# EasyEDA Pro project busmaster-v101.eprj, schematic main-board

## Sheets
1 psu: Board Name: main-board; Create Date: 2025-09-19; Page Name: psu; Project Name: busmaster-v101; Schematic Name: main-board; Update Date: 2025-11-22; Company: EasyEDA.com; Page Size: A4; Version: V1.0
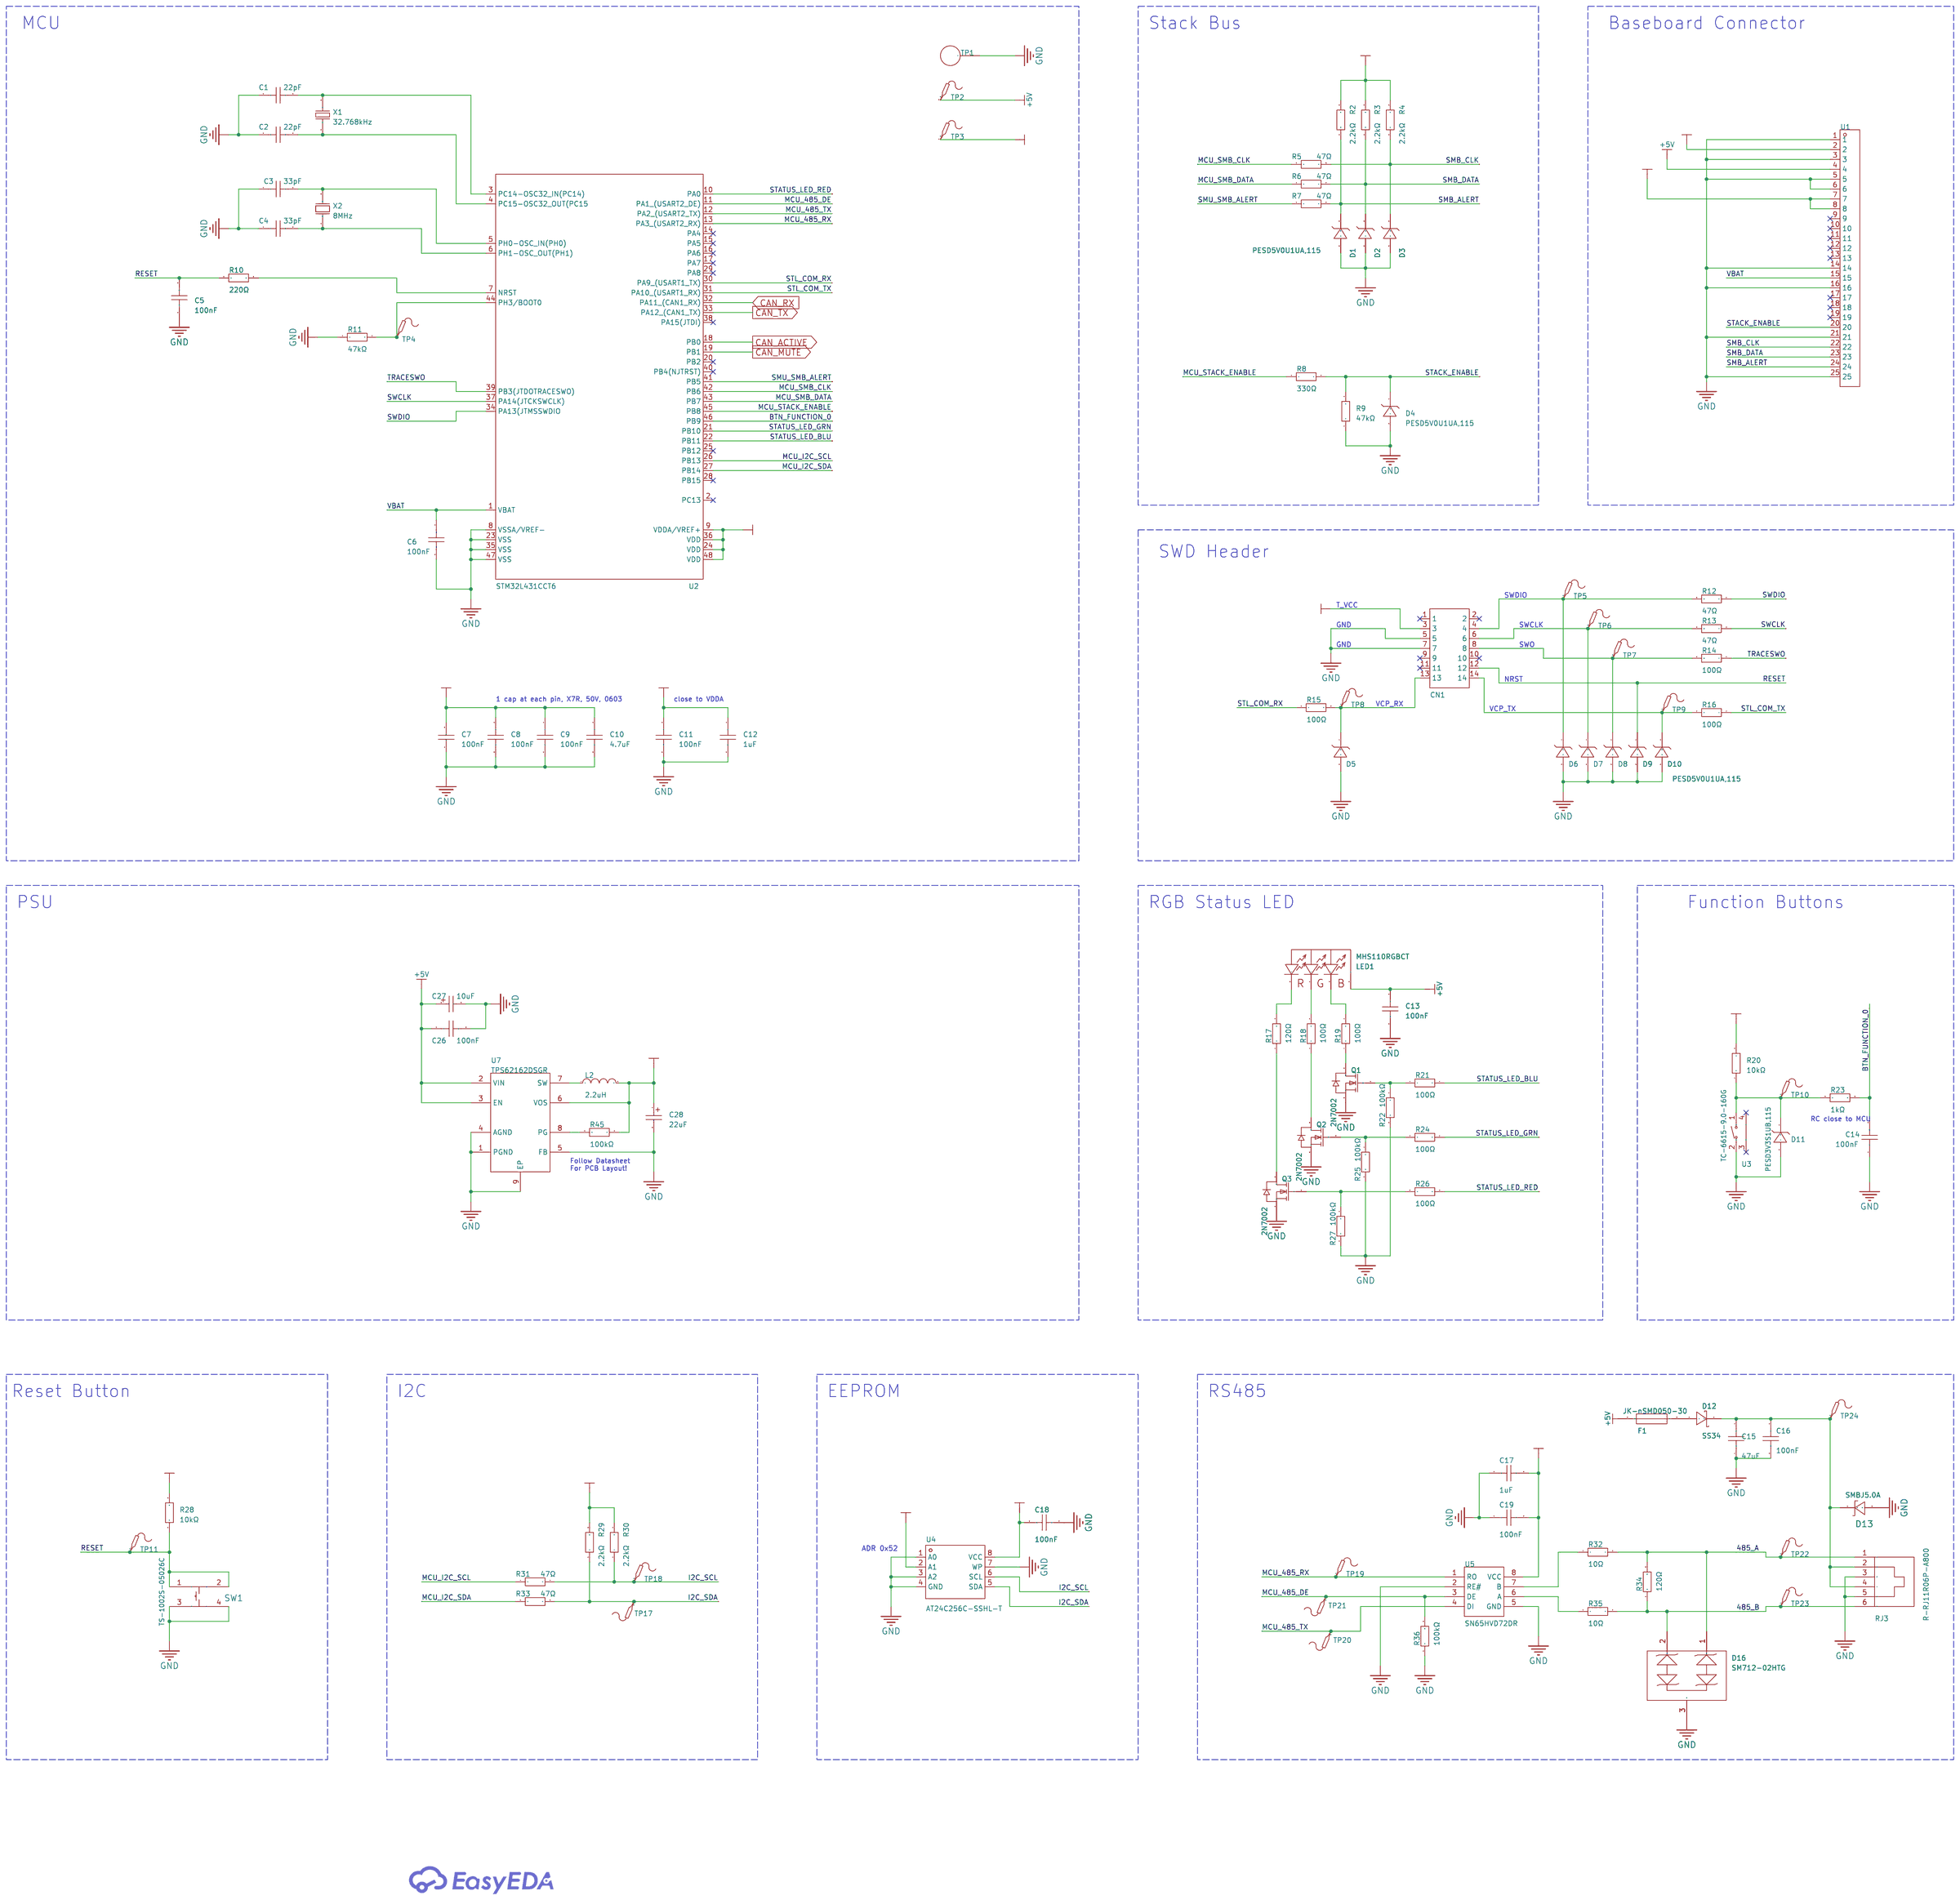
[diagram p1: psu]
2 can: Create Date: 2025-11-20; Page Name: can
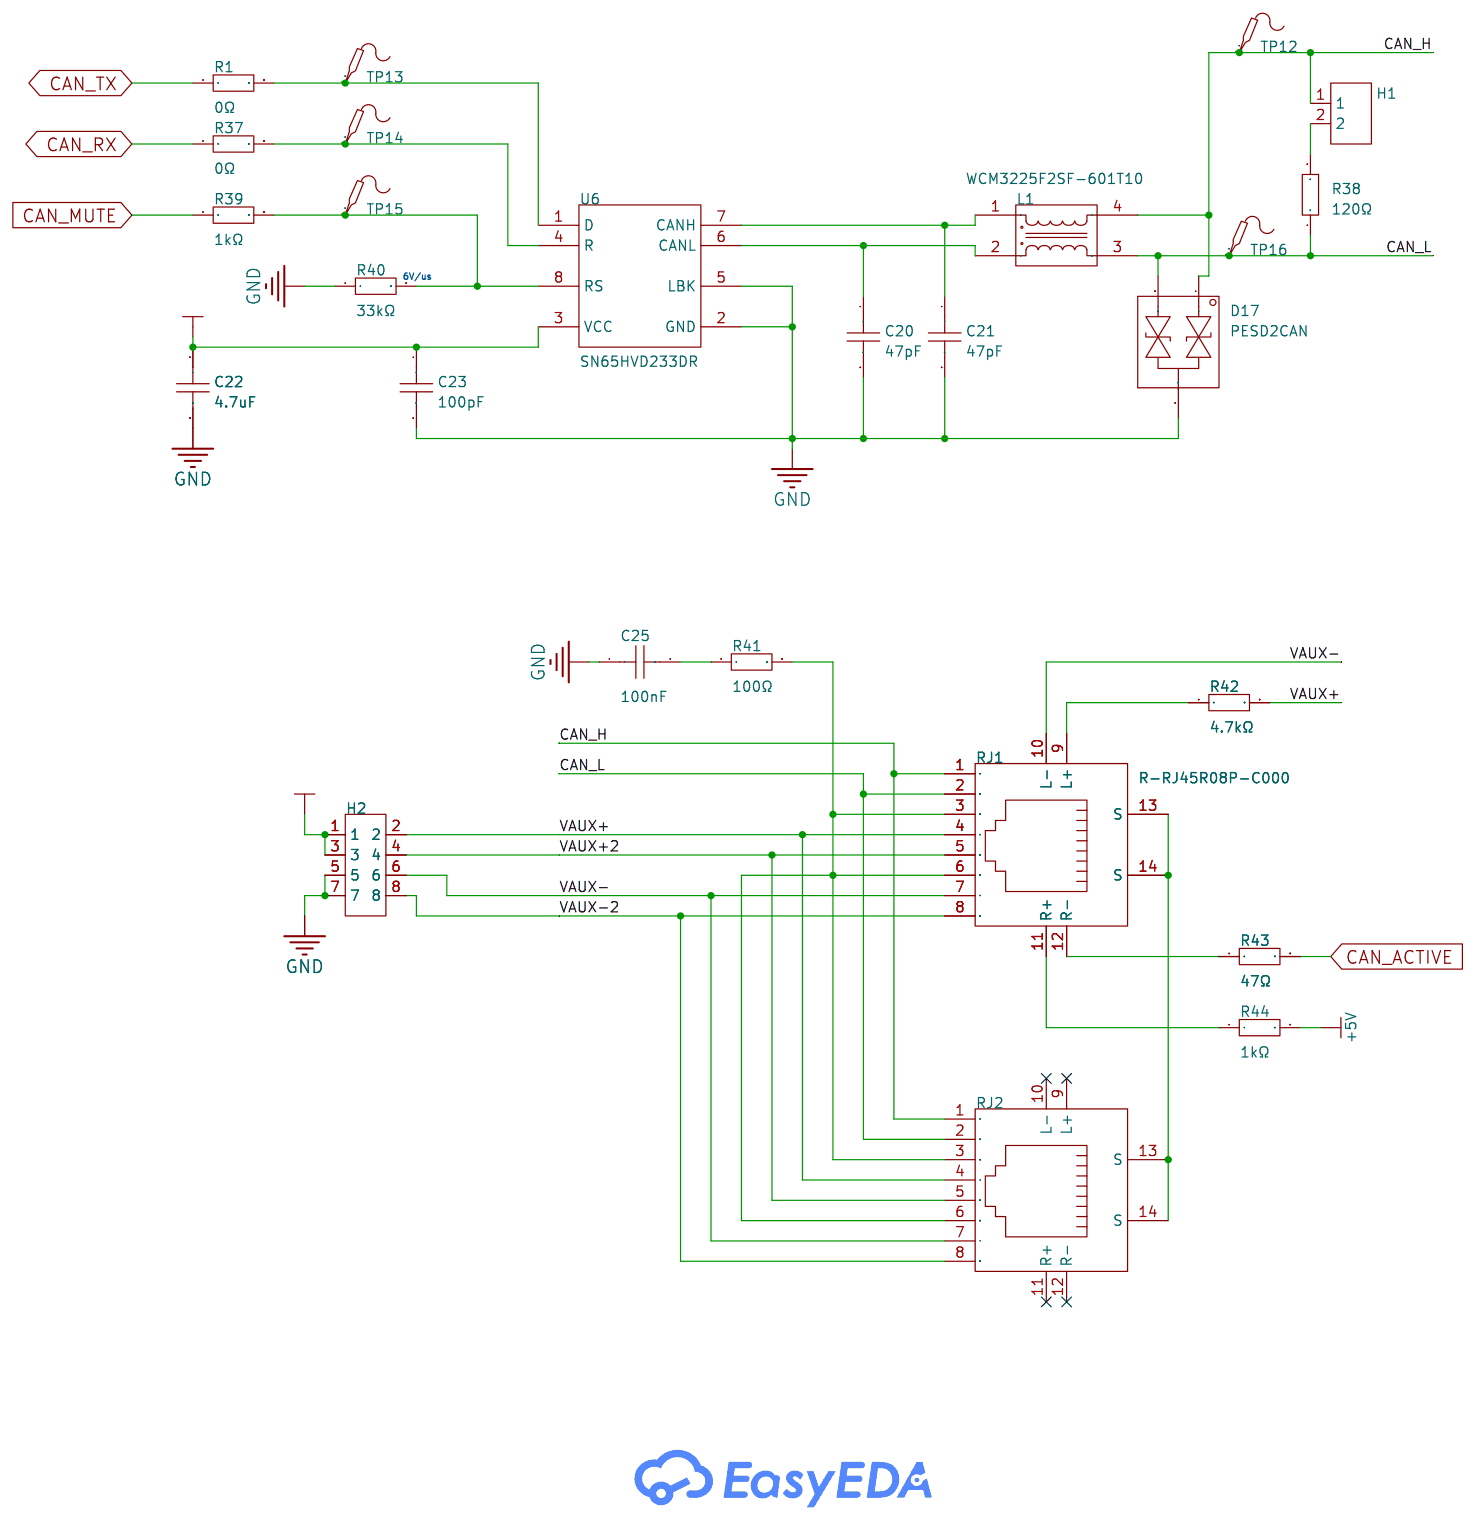
[diagram p2: can]

## Parts
sheet can
C20  47pF  [C0603]
C21  47pF  [C0603]
C22  4.7uF  [C0603]
C23  100pF  [C0603]
C25  100nF  [C0603]
D17  PESD2CAN  [SOT-23-3_L2.9-W1.3-P1.90-LS2.4-BR]
H1  PZ254V-11-02P  [HDR-TH_2P-P2.54-V-M]
H2  PZ254V-12-8P  [HDR-TH_8P-P2.54-V-M-R2-C4-S2.54]  (no BOM)
L1  WCM3225F2SF-601T10  [FILTER-SMD_4P-L3.2-W2.5-TL_ACM3225]
R1  0Ω  [R0603]
R37  0Ω  [R0603]
R38  120Ω  [R1206]
R39  1kΩ  [R0603]
R40  33kΩ  [R0603]
R41  100Ω  [R1206]
R42  4.7kΩ  [R0603]
R43  47Ω  [R0603]
R44  1kΩ  [R0603]
RJ1  R-RJ45R08P-C000  [RJ45-TH_R-RJ45R08P-C000]
RJ2  R-RJ45R08P-C000  [RJ45-TH_R-RJ45R08P-C000]
TP12  -  [Test-Point-0.5mm]
TP13  -  [Test-Point-0.5mm]
TP14  -  [Test-Point-0.5mm]
TP15  -  [Test-Point-0.5mm]
TP16  -  [Test-Point-0.5mm]
U6  SN65HVD233DR  [SOIC-8_L5.0-W4.0-P1.27-LS6.0-BL]
sheet psu
C1  22pF  [C0603]
C2  22pF  [C0603]
C3  33pF  [C0603]
C4  33pF  [C0603]
C5  100nF  [C0603]
C6  100nF  [C0603]
C7  100nF  [C0603]
C8  100nF  [C0603]
C9  100nF  [C0603]
C10  4.7uF  [C0603]
C11  100nF  [C0603]
C12  1uF  [C0603]
C13  100nF  [C0603]
C14  100nF  [C0603]
C15  47uF  [C1206]
C16  100nF  [C0603]
C17  1uF  [C0603]
C18  100nF  [C0603]
C19  100nF  [C0603]
C26  100nF  [C0603]
C27  10uF  [C0805]
C28  22uF  [C1206]
CN1  HX PZ1.27-2x7P WZ  [HDR-TH_14P-P1.27-H-M-R2-C7-S1.27-W7.5-N]
D1  PESD5V0U1UA,115  [SOD-323_L1.8-W1.3-LS2.5-RD]
D2  PESD5V0U1UA,115  [SOD-323_L1.8-W1.3-LS2.5-RD]
D3  PESD5V0U1UA,115  [SOD-323_L1.8-W1.3-LS2.5-RD]
D4  PESD5V0U1UA,115  [SOD-323_L1.8-W1.3-LS2.5-RD]
D5  PESD5V0U1UA,115  [SOD-323_L1.8-W1.3-LS2.5-RD]
D6  PESD5V0U1UA,115  [SOD-323_L1.8-W1.3-LS2.5-RD]
D7  PESD5V0U1UA,115  [SOD-323_L1.8-W1.3-LS2.5-RD]
D8  PESD5V0U1UA,115  [SOD-323_L1.8-W1.3-LS2.5-RD]
D9  PESD5V0U1UA,115  [SOD-323_L1.8-W1.3-LS2.5-RD]
D10  PESD5V0U1UA,115  [SOD-323_L1.8-W1.3-LS2.5-RD]
D11  PESD3V3S1UB,115  [SOD-523_L1.2-W0.8-LS1.6-RD]
D12  SS34  [SMA_L4.3-W2.6-LS5.2-RD]
D13  SMBJ5.0A  [SMB_L4.6-W3.6-LS5.3-RD]
D16  SM712-02HTG  [SOT-23_L2.9-W1.3-P1.90-LS2.4-BR]
F1  JK-nSMD050-30  [F1206]
L2  2.2uH  [IND-SMD_L2.0-W1.6-1]
LED1  MHS110RGBCT  [LED-ARRAY-SMD_MHS110RGBCT]
Q1  2N7002  [SOT-23-3_L2.9-W1.3-P1.90-LS2.4-BR]
Q2  2N7002  [SOT-23-3_L2.9-W1.3-P1.90-LS2.4-BR]
Q3  2N7002  [SOT-23-3_L2.9-W1.3-P1.90-LS2.4-BR]
R2  2.2kΩ  [R0603]
R3  2.2kΩ  [R0603]
R4  2.2kΩ  [R0603]
R5  47Ω  [R0603]
R6  47Ω  [R0603]
R7  47Ω  [R0603]
R8  330Ω  [R0603]
R9  47kΩ  [R0603]
R10  220Ω  [R0603]
R11  47kΩ  [R0603]
R12  47Ω  [R0603]
R13  47Ω  [R0603]
R14  100Ω  [R0603]
R15  100Ω  [R0603]
R16  100Ω  [R0603]
R17  120Ω  [R0603]
R18  100Ω  [R0603]
R19  100Ω  [R0603]
R20  10kΩ  [R0603]
R21  100Ω  [R0603]
R22  100kΩ  [R0603]
R23  1kΩ  [R0603]
R24  100Ω  [R0603]
R25  100kΩ  [R0603]
R26  100Ω  [R0603]
R27  100kΩ  [R0603]
R28  10kΩ  [R0603]
R29  2.2kΩ  [R0603]
R30  2.2kΩ  [R0603]
R31  47Ω  [R0603]
R32  10Ω  [R1206]
R33  47Ω  [R0603]
R34  120Ω  [R1206]
R35  10Ω  [R1206]
R36  100kΩ  [R0603]
R45  100kΩ  [R0603]
RJ3  R-RJ11R06P-A800  [RJ11-TH_PCB-6P6C-90]
SW1  TS-1002S-05026C  [KEY-SMD_4P-L6.0-W6.0-P4.50-LS9.0]
TP1  RH-5004  [TESTPOINT_TH_BD2.5-D1.2]
TP2  -  [Test-Point-0.5mm]
TP3  -  [Test-Point-0.5mm]
TP4  -  [Test-Point-0.5mm]
TP5  -  [Test-Point-0.5mm]
TP6  -  [Test-Point-0.5mm]
TP7  -  [Test-Point-0.5mm]
TP8  -  [Test-Point-0.5mm]
TP9  -  [Test-Point-0.5mm]
TP10  -  [Test-Point-0.5mm]
TP11  -  [Test-Point-0.5mm]
TP17  -  [Test-Point-0.5mm]
TP18  -  [Test-Point-0.5mm]
TP19  -  [Test-Point-0.5mm]
TP20  -  [Test-Point-0.5mm]
TP21  -  [Test-Point-0.5mm]
TP22  -  [Test-Point-0.5mm]
TP23  -  [Test-Point-0.5mm]
TP24  -  [Test-Point-0.5mm]
U1  KH-2PH90-1X25P-L10.5  [HDR-TH_25P-P2.00-H-M-W7.5-N]
U2  STM32L431CCT6  [LQFP-48_L7.0-W7.0-P0.50-LS9.0-BL]
U3  TC-6615-9.0-160G  [KEY-TH_PTS645VXX83XLFS]
U4  AT24C256C-SSHL-T  [SOIC-8_L4.9-W3.9-P1.27-LS6.0-BL]
U5  SN65HVD72DR  [SOIC-8_L5.0-W4.0-P1.27-LS6.0-BL]
U7  TPS62162DSGR  [WSON-8_L2.0-W2.0-P0.50-TL-EP]
X1  32.768kHz  [FC-135R_L3.2-W1.5]
X2  8MHz  [CRYSTAL-SMD_L5.0-W3.2]

## Library data of the parts
C20 C21 = CL10C470JB8NNNC: Capacitance:47pF Tolerance:±5% Tolerance:±5% Voltage Rating:50V Temperature Coefficient:C0G; LCSC Part Name: 47pF ±5% 50V; Supplier Part: C1671; Manufacturer: SAMSUNG(三星); Supplier Footprint: 0603; JLCPCB Part Class: Basic Part; Datasheet: https://item.szlcsc.com/datasheet/CL10C470JB8NNNC/2023.html; Supplier: LCSC; Tolerance: ±5%; Voltage Rating: 50V; Temperature Coefficient: C0G
C10 C22 = CL10A475KO8NNNC: Capacitance:4.7uF Tolerance:±10% Tolerance:±10% Voltage Rating:16V Temperature Coefficient:X5R; LCSC Part Name: 4.7uF ±10% 16V; Supplier Part: C19666; Manufacturer: SAMSUNG(三星); Supplier Footprint: 0603; JLCPCB Part Class: Basic Part; Datasheet: https://item.szlcsc.com/datasheet/CL10A475KO8NNNC/20375.html; Supplier: LCSC; Tolerance: ±10%; Voltage Rating: 16V; Temperature Coefficient: X5R
C23 = CL10C101JB8NNNC: Capacitance:100pF Tolerance:±5% Tolerance:±5% Voltage Rating:50V Temperature Coefficient:C0G; LCSC Part Name: 100pF ±5% 50V; Supplier Part: C14858; Manufacturer: SAMSUNG(三星); Supplier Footprint: 0603; JLCPCB Part Class: Basic Part; Datasheet: https://item.szlcsc.com/datasheet/CL10C101JB8NNNC/15530.html; Supplier: LCSC; Tolerance: ±5%; Voltage Rating: 50V; Temperature Coefficient: C0G
C5-C9 C11 C13 C14 C16 C18 C19 C25 C26 = CC0603KRX7R9BB104: Capacitance:100nF Tolerance:±10% Tolerance:±10% Voltage Rating:50V Temperature Coefficient:X7R; LCSC Part Name: 100nF ±10% 50V; Supplier Part: C14663; Manufacturer: YAGEO(国巨); Supplier Footprint: 0603; JLCPCB Part Class: Basic Part; Datasheet: https://item.szlcsc.com/datasheet/CC0603KRX7R9BB104/15331.html; Supplier: LCSC; Tolerance: ±10%; Voltage Rating: 50V; Temperature Coefficient: X7R
D17 = PESD2CAN: Supplier Part: C284078; Manufacturer: DOWO(东沃); Supplier Footprint: SOT-23; JLCPCB Part Class: Extended Part; Datasheet: https://item.szlcsc.com/datasheet/PESD2CAN/269579.html; Supplier: LCSC; Reverse Stand-Off Voltage (Vrwm): 24V; Clamping Voltage: 54V; Peak Pulse Current (Ipp): 8A@8/20us; Voltage - Breakdown: 26.7V; Type: TVS
H1 = PZ254V-11-02P: LCSC Part Name: 1x2P 间距:2.54mm 方针 直插; Supplier Part: C492401; Manufacturer: XFCN(兴飞); Supplier Footprint: 插件,P=2.54mm; JLCPCB Part Class: Extended Part; Datasheet: https://item.szlcsc.com/datasheet/PZ254V-11-02P/502957.html; Supplier: LCSC; Pin Structure: 1x2P; Pitch: 2.54mm; Circluar Pins/Square Pins: Pin Header; Mounting Type: Through Hole; Number of Rows: 1; Number of Pins: 2P; Length of Mating Pin: 6mm; Insulation Height: 2.5mm; Length of End Connection Pin: 3mm; Contact Material: Brass; Operating Temperature: -40℃~+105℃; Color: Black
H2 = PZ254V-12-8P: LCSC Part Name: 2x4P 间距:2.54mm 方针 直插; Supplier Part: C492421; Manufacturer: XFCN(兴飞); Supplier Footprint: 插件,P=2.54mm; JLCPCB Part Class: Extended Part; Datasheet: https://item.szlcsc.com/datasheet/PZ254V-12-8P/502977.html; Supplier: LCSC; Pin Structure: 2x4P; Pitch: 2.54mm; Row Spacing: 2.54mm; Circluar Pins/Square Pins: Pin Header; Mounting Type: Through Hole; Number of Rows: 2; Number of Pins: 8P; Length of Mating Pin: 6mm; Insulation Height: 2.5mm; Length of End Connection Pin: 3mm; Contact Material: Brass; Operating Temperature: -40℃~+105℃; Color: Black
L1 = WCM3225F2SF-601T10: LCSC Part Name: 两路 贴片共模滤波器 阻抗600Ω@100MHz; Supplier Part: C192894; Manufacturer: TAI-TECH(台庆); Supplier Footprint: SMD-4P,3.2x2.5mm; JLCPCB Part Class: Extended Part; Datasheet: https://item.szlcsc.com/datasheet/WCM3225F2SF-601T10/225854.html; Supplier: LCSC; Number of Lines: 2; Current Rating: 1A; Impedance @ Frequency: 600Ω@100MHz; Voltage Rating - DC: 50V; Voltage Withstand: 125V; DC Resistance(DCR): 200mΩ; Operating Temperature: -40℃~+125℃; Insulation Resistance(IR): 10MΩ
R1 R37 = 0603WAF0000T5E: Type:Thick Film Resistor Resistance:0Ω Tolerance:±1% Tolerance:±1% Power(Watts):100mW Voltage-Supply(Max):75V Temperature Coefficient:- Temperature Coefficient:- Operating Temperature:-55℃~+155℃ Operating Temperature:-55℃~+155℃; LCSC Part Name: 0Ω ±1% 100mW 厚膜电阻; Supplier Part: C21189; Manufacturer: UNI-ROYAL(厚声); Supplier Footprint: 0603; JLCPCB Part Class: Basic Part; Datasheet: https://item.szlcsc.com/datasheet/0603WAF0000T5E/21903.html; Supplier: LCSC; Type: Thick Film Resistor; Tolerance: ±1%; Power(Watts): 100mW; Voltage-Supply(Max): 75V; Operating Temperature: -55℃~+155℃
R34 R38 = 1206W4F1200T5E_C17909: Type:Thick Film Resistor Resistance:120Ω Tolerance:±1% Tolerance:±1% Power(Watts):250mW Voltage-Supply(Max):200V Temperature Coefficient:±100ppm/℃ Temperature Coefficient:±100ppm/℃ Operating Temperature:-55℃~+155℃ Operating Temperature:-55℃~+155℃; LCSC Part Name: 120Ω ±1% 250mW 厚膜电阻; Supplier Part: C17909; Manufacturer: UNI-ROYAL(厚声); Manufacturer Part: 1206W4F1200T5E; Supplier Footprint: 1206; JLCPCB Part Class: Basic Part; Datasheet: https://item.szlcsc.com/datasheet/1206W4F1200T5E/18597.html; Supplier: LCSC; Type: Thick Film Resistor; Tolerance: ±1%; Power(Watts): 250mW; Voltage-Supply(Max): 200V; Temperature Coefficient: ±100ppm/℃; Operating Temperature: -55℃~+155℃
R39 R44 = 0603WAF1001T5E: Type:Thick Film Resistor Resistance:1kΩ Tolerance:±1% Tolerance:±1% Power(Watts):100mW Voltage-Supply(Max):75V Temperature Coefficient:±100ppm/℃ Temperature Coefficient:±100ppm/℃ Operating Temperature:-55℃~+155℃ Operating Temperature:-55℃~+155℃; LCSC Part Name: 1kΩ ±1% 100mW 厚膜电阻; Supplier Part: C21190; Manufacturer: UNI-ROYAL(厚声); Supplier Footprint: 0603; JLCPCB Part Class: Basic Part; Datasheet: https://atta.szlcsc.com/upload/public/pdf/source/20200306/C422600_1E6D84923E4A46A82E41ADD87F860B5C.pdf; Supplier: LCSC; Type: Thick Film Resistors; Tolerance: ±1%; Power(Watts): 100mW; Temperature Coefficient: ±100ppm/℃; Operating Temperature Range: -55℃~+155℃; Voltage-Supply(Max): 75V; Operating Temperature: -55℃~+155℃
R40 = 0603WAF3302T5E: Type:Thick Film Resistor Resistance:33kΩ Tolerance:±1% Tolerance:±1% Power(Watts):100mW Voltage-Supply(Max):75V Temperature Coefficient:±100ppm/℃ Temperature Coefficient:±100ppm/℃ Operating Temperature:-55℃~+155℃ Operating Temperature:-55℃~+155℃; LCSC Part Name: 33kΩ ±1% 100mW 厚膜电阻; Supplier Part: C4216; Manufacturer: UNI-ROYAL(厚声); Supplier Footprint: 0603; JLCPCB Part Class: Basic Part; Datasheet: https://item.szlcsc.com/datasheet/0603WAF3302T5E/4623.html; Supplier: LCSC; Type: Thick Film Resistor; Tolerance: ±1%; Power(Watts): 100mW; Voltage-Supply(Max): 75V; Temperature Coefficient: ±100ppm/℃; Operating Temperature: -55℃~+155℃
R41 = 1206W4F1000T5E_C17901: Type:Thick Film Resistor Resistance:100Ω Tolerance:±1% Tolerance:±1% Power(Watts):250mW Voltage-Supply(Max):200V Temperature Coefficient:±100ppm/℃ Temperature Coefficient:±100ppm/℃ Operating Temperature:-55℃~+155℃ Operating Temperature:-55℃~+155℃; LCSC Part Name: 100Ω ±1% 250mW 厚膜电阻; Supplier Part: C17901; Manufacturer: UNI-ROYAL(厚声); Manufacturer Part: 1206W4F1000T5E; Supplier Footprint: 1206; JLCPCB Part Class: Basic Part; Datasheet: https://item.szlcsc.com/datasheet/1206W4F1000T5E/18589.html; Supplier: LCSC; Type: Thick Film Resistor; Tolerance: ±1%; Power(Watts): 250mW; Voltage-Supply(Max): 200V; Temperature Coefficient: ±100ppm/℃; Operating Temperature: -55℃~+155℃
R42 = 0603WAF4701T5E: Type:Thick Film Resistor Resistance:4.7kΩ Tolerance:±1% Tolerance:±1% Power(Watts):100mW Voltage-Supply(Max):75V Temperature Coefficient:±100ppm/℃ Temperature Coefficient:±100ppm/℃ Operating Temperature:-55℃~+155℃ Operating Temperature:-55℃~+155℃; LCSC Part Name: 4.7kΩ ±1% 100mW 厚膜电阻; Supplier Part: C23162; Manufacturer: UNI-ROYAL(厚声); Supplier Footprint: 0603; JLCPCB Part Class: Basic Part; Datasheet: https://item.szlcsc.com/datasheet/0603WAF4701T5E/23889.html; Supplier: LCSC; Type: Thick Film Resistor; Tolerance: ±1%; Power(Watts): 100mW; Voltage-Supply(Max): 75V; Temperature Coefficient: ±100ppm/℃; Operating Temperature: -55℃~+155℃
R5-R7 R12 R13 R31 R33 R43 = 0603WAF470JT5E: Type:Thick Film Resistor Resistance:47Ω Tolerance:±1% Tolerance:±1% Power(Watts):100mW Voltage-Supply(Max):75V Temperature Coefficient:±100ppm/℃ Temperature Coefficient:±100ppm/℃ Operating Temperature:-55℃~+155℃ Operating Temperature:-55℃~+155℃; LCSC Part Name: 47Ω ±1% 100mW 厚膜电阻; Supplier Part: C23182; Manufacturer: UNI-ROYAL(厚声); Supplier Footprint: 0603; JLCPCB Part Class: Basic Part; Datasheet: https://item.szlcsc.com/datasheet/0603WAF470JT5E/23909.html; Supplier: LCSC; Type: Thick Film Resistor; Tolerance: ±1%; Power(Watts): 100mW; Voltage-Supply(Max): 75V; Temperature Coefficient: ±100ppm/℃; Operating Temperature: -55℃~+155℃
RJ1 RJ2 = R-RJ45R08P-C000: LCSC Part Name: 弯插 带LED; Supplier Part: C386757; Manufacturer: Ckmtw(灿科盟); Supplier Footprint: 插件; JLCPCB Part Class: Extended Part; Datasheet: https://item.szlcsc.com/datasheet/R-RJ45R08P-C000/360864.html; Supplier: LCSC; Connector Type: RJ45 Jack; Mounting Type: Right Angle; Number of Ports: 1; LED: With LED; Shielding: Shielded; Supplementary Features: Harpoon Contact (Plastic); Operating Temperature: 0℃~+70℃
TP2-TP24 = Test-Point
U6 = SN65HVD233DR: LCSC Part Name: SN65HVD233 3.3-V CAN总线收发器; Supplier Part: C61643; Manufacturer: TI(德州仪器); Supplier Footprint: SOIC-8; JLCPCB Part Class: Extended Part; Datasheet: https://www.ti.com/cn/lit/gpn/sn65hvd233; Supplier: LCSC; Type: CANtransceiver; Data Rate: 1Mbps; Supply Voltage: 3V~3.6V; Supply Current: 6mA; Operating Temperature: -40℃~+125℃
C1 C2 = CL10C220JB8NNNC: Capacitance:22pF Tolerance:±5% Tolerance:±5% Voltage Rating:50V Temperature Coefficient:C0G; LCSC Part Name: 22pF ±5% 50V; Supplier Part: C1653; Manufacturer: SAMSUNG(三星); Supplier Footprint: 0603; JLCPCB Part Class: Basic Part; Datasheet: https://item.szlcsc.com/datasheet/CL10C220JB8NNNC/2005.html; Supplier: LCSC; Tolerance: ±5%; Voltage Rating: 50V; Temperature Coefficient: C0G
C3 C4 = CL10C330JB8NNNC: Capacitance:33pF Tolerance:±5% Tolerance:±5% Voltage Rating:50V Temperature Coefficient:C0G; LCSC Part Name: 33pF ±5% 50V; Supplier Part: C1663; Manufacturer: SAMSUNG(三星); Supplier Footprint: 0603; JLCPCB Part Class: Basic Part; Datasheet: https://item.szlcsc.com/datasheet/CL10C330JB8NNNC/2015.html; Supplier: LCSC; Tolerance: ±5%; Voltage Rating: 50V; Temperature Coefficient: C0G
C12 C17 = CL10A105KB8NNNC: Capacitance:1uF Tolerance:±10% Tolerance:±10% Voltage Rating:50V Temperature Coefficient:X5R; LCSC Part Name: 1uF ±10% 50V; Supplier Part: C15849; Manufacturer: SAMSUNG(三星); Supplier Footprint: 0603; JLCPCB Part Class: Basic Part; Datasheet: https://item.szlcsc.com/datasheet/CL10A105KB8NNNC/16531.html; Supplier: LCSC; Tolerance: ±10%; Voltage Rating: 50V; Temperature Coefficient: X5R; Check: true
C15 = CL31A476MPHNNNE: Capacitance:47uF Tolerance:±20% Tolerance:±20% Voltage Rating:10V Temperature Coefficient:X5R; LCSC Part Name: 47uF ±20% 10V; Supplier Part: C96123; Manufacturer: SAMSUNG(三星); Supplier Footprint: 1206; JLCPCB Part Class: Basic Part; Datasheet: https://item.szlcsc.com/datasheet/CL31A476MPHNNNE/97327.html; Supplier: LCSC; Tolerance: ±20%; Voltage Rating: 10V; Temperature Coefficient: X5R
C27 = CL21A106KAYNNNE_C15850: Capacitance:10uF Tolerance:±10% Tolerance:±10% Voltage Rating:25V Temperature Coefficient:X5R; LCSC Part Name: 10uF ±10% 25V; Supplier Part: C15850; Manufacturer: SAMSUNG(三星); Manufacturer Part: CL21A106KAYNNNE; Supplier Footprint: 0805; JLCPCB Part Class: Basic Part; Datasheet: https://item.szlcsc.com/datasheet/CL21A106KAYNNNE/16532.html; Supplier: LCSC; Tolerance: ±10%; Voltage Rating: 25V; Temperature Coefficient: X5R
C28 = CL31A226KAHNNNE: Capacitance:22uF Tolerance:±10% Tolerance:±10% Voltage Rating:25V Temperature Coefficient:X5R; LCSC Part Name: 22uF ±10% 25V; Supplier Part: C12891; Manufacturer: SAMSUNG(三星); Supplier Footprint: 1206; JLCPCB Part Class: Basic Part; Datasheet: https://item.szlcsc.com/datasheet/CL31A226KAHNNNE/13537.html; Supplier: LCSC; Tolerance: ±10%; Voltage Rating: 25V; Temperature Coefficient: X5R
CN1 = HX PZ1.27-2x7P WZ: Pin Structure:2x7P Pitch:1.27mm Row Spacing:1.27mm Circluar Pins/Square Pins:Pin Header Mounting Type:Right Angle Number of Rows:2 Number of Pins:14P Current Rating:1A Voltage Rating (Max):500V Length of Mating Pin:4mm Insulation Height:1mm Length of End; LCSC Part Name: 2x7P 间距:1.27mm 方针 弯插; Supplier Part: C22438113; Manufacturer: hanxia(韩下); Supplier Footprint: 弯插,P=1.27mm; JLCPCB Part Class: Extended Part; Datasheet: https://item.szlcsc.com/datasheet/HX%2520PZ1.27-2x7P%2520WZ/24075358.html; Supplier: LCSC; Pin Structure: 2x7P; Pitch: 1.27mm; Row Spacing: 1.27mm; Circluar Pins/Square Pins: Pin Header; Mounting Type: Right Angle; Number of Rows: 2; Number of Pins: 14P; Current Rating: 1A; Voltage Rating (Max): 500V; Length of Mating Pin: 4mm; Insulation Height: 1mm; Contact Material: Brass; Contact Plating: Gold; Operating Temperature: -40℃~+105℃; Color: Black
D1-D10 = PESD5V0U1UA,115: LCSC Part Name: 单向ESD; Supplier Part: C139614; Manufacturer: Nexperia(安世); Supplier Footprint: SOD-323; JLCPCB Part Class: Extended Part; Datasheet: https://item.szlcsc.com/datasheet/PESD5V0U1UA%252C115/150939.html; Supplier: LCSC; Polarity: Unidirectional; Reverse Stand-Off Voltage (Vrwm): 5V; Clamping Voltage: 11V; Peak Pulse Current (Ipp): 1.3A@8/20us; Voltage - Breakdown: 8.8V; Reverse Leakage Current (Ir): 1nA; Number of Channels: 1; Operating Temperature: -55℃~+150℃@(Ta); level of protection: IEC 61000-4-2; Type: ESD; Junction Capacitance: 2pF
D11 = PESD3V3S1UB,115: LCSC Part Name: 单向ESD; Supplier Part: C85377; Manufacturer: Nexperia(安世); Supplier Footprint: SC-79(SOD-523); JLCPCB Part Class: Extended Part; Datasheet: https://item.szlcsc.com/datasheet/PESD3V3S1UB%252C115/86550.html; Supplier: LCSC; Polarity: Unidirectional; Reverse Stand-Off Voltage (Vrwm): 3.3V; Clamping Voltage: 20V; Peak Pulse Current (Ipp): 18A; Peak Pulse Power Dissipation (Ppp): 330W; Voltage - Breakdown: 5.2V; Number of Channels: 1; Operating Temperature: -65℃~+150℃@(Ta); Type: ESD
D12 = SS34_C8678: LCSC Part Name: 电压:40V 电流:3A; Supplier Part: C8678; Manufacturer: MDD(辰达半导体); Supplier Footprint: SMA(DO-214AC); JLCPCB Part Class: Basic Part; Datasheet: https://item.szlcsc.com/datasheet/SS34/9178.html; Supplier: LCSC; Diode Configuration: Independent; Voltage - Forward(Vf@If): 550mV@3A; Voltage - DC Reverse(Vr): 40V; Current - Rectified: 3A; Reverse Leakage Current (Ir): 500uA@40V; Operating Junction Temperature Range: -55℃~+125℃
D13 = SMBJ5.0A_C10204: Polarity:Unidirectional Reverse Stand-Off Voltage (Vrwm):5V Clamping Voltage:9.2V Peak Pulse Current (Ipp):65.3A@10/1000us Peak Pulse Power Dissipation (Ppp):600W@10/1000us Voltage - Breakdown:7.25V Reverse Leakage Current (Ir):800uA Operating Temperature; LCSC Part Name: 单向TVS 5V截止 峰值浪涌电流：65.3A@10/1000us; Supplier Part: C10204; Manufacturer: RUILON(瑞隆源); Supplier Footprint: DO-214AA(SMB); JLCPCB Part Class: Extended Part; Datasheet: https://item.szlcsc.com/datasheet/SMBJ5.0A/10744.html; Supplier: LCSC; Polarity: Unidirectional; Reverse Stand-Off Voltage (Vrwm): 5V; Clamping Voltage: 9.2V; Peak Pulse Current (Ipp): 65.3A@10/1000us; Peak Pulse Power Dissipation (Ppp): 600W@10/1000us; Voltage - Breakdown: 7.25V; Reverse Leakage Current (Ir): 800uA; Operating Temperature: -55℃~+150℃; level of protection: IEC 61000-4-4；IEC 61000-4-2; Type: TVS
D16 = SM712-02HTG_C172881: Supplier Part: C172881; Manufacturer: Littelfuse(美国力特); Supplier Footprint: SOT-23; JLCPCB Part Class: Extended Part; Datasheet: https://item.szlcsc.com/datasheet/SM712-02HTG/184270.html; Supplier: LCSC; Polarity: Bidirectional; Reverse Stand-Off Voltage (Vrwm): 7V；12V; Clamping Voltage: 19V；31V; Peak Pulse Current (Ipp): 19A@8/20us; Peak Pulse Power Dissipation (Ppp): 600W@8/20us; Voltage - Breakdown: 7.5V；13.3V; Reverse Leakage Current (Ir): 20uA; Operating Temperature: -40℃~+125℃; level of protection: IEC 61000-4-4；IEC 61000-4-5；IEC 61000-4-2; Type: TVS; Junction Capacitance: 75pF
F1 = JK-nSMD050-30: Voltage - Max:30V Current - Max:100A Hold Current:500mA Trip Current:1A Power Dissipation:600mW Resistance - Initial (Ri) (Min):150mΩ Resistance - Post Trip (R1) (Max):300mΩ Time to Trip(Max):100ms Operating Temperature:-40℃~+85℃ Operating Temperature:-40; LCSC Part Name: 30V 500mA 1206自恢复; Supplier Part: C720075; Manufacturer: JK(金科); Supplier Footprint: 1206; JLCPCB Part Class: Extended Part; Datasheet: https://item.szlcsc.com/datasheet/JK-nSMD050-30/764095.html; Supplier: LCSC; Voltage - Max: 30V; Current - Max: 100A; Hold Current: 500mA; Trip Current: 1A; Power Dissipation: 600mW; Resistance - Initial (Ri) (Min): 150mΩ; Resistance - Post Trip (R1) (Max): 300mΩ; Time to Trip(Max): 100ms; Operating Temperature: -40℃~+85℃; Length: 3.5mm; Width: 1.8mm; Height: 1.2mm
L2 = TFM201610ALMA2R2MTAA: Inductance: Tolerance:±20% Tolerance:±20% Rated Current: Saturation Current (Isat): DC Resistance (DCR): Q @ Freq:- Frequency - Self Resonant:- Ratings:AEC-Q200; LCSC Part Name: 2.2uH ±20% 2A; Supplier Part: C404810; Manufacturer: TDK; Supplier Footprint: SMD,1.6x2mm; JLCPCB Part Class: Extended Part; Datasheet: https://atta.szlcsc.com/upload/public/pdf/source/20190717/C404810_ABF5B38A636D8F3C7C774ECB5D7697CD.pdf; Supplier: LCSC; Tolerance: ±20%; Ratings: AEC-Q200
LED1 = MHS110RGBCT: LCSC Part Name: RGB三色 侧贴; Supplier Part: C389528; Manufacturer: MEIHUA(美华); Supplier Footprint: SMD,1.5x3mm; JLCPCB Part Class: Extended Part; Datasheet: https://atta.szlcsc.com/upload/public/pdf/source/20190530/C389528_18CC971B89683121AF99AD38EE2CA1FC.pdf; Supplier: LCSC
Q1-Q3 = 2N7002_C8545: LCSC Part Name: 1个N沟道 耐压:60V 电流:115mA; Supplier Part: C8545; Manufacturer: CJ(江苏长电/长晶); Supplier Footprint: SOT-23; JLCPCB Part Class: Basic Part; Datasheet: https://item.szlcsc.com/datasheet/2N7002/9040.html; Supplier: LCSC; Number: 1 N-Channel; Drain to Source Voltage: 60V; Current - Continuous Drain(Id): 115mA; RDS(on): 5Ω@10V; Pd - Power Dissipation: 225mW; Gate Threshold Voltage (Vgs(th)): 2.5V; Input Capacitance(Ciss): 50pF; Reverse Transfer Capacitance (Crss@Vds): 5pF
R2-R4 R29 R30 = 0603WAF2201T5E_C4190: Type:Thick Film Resistors Resistance:2.2kΩ Tolerance:±1% Tolerance:±1% Power(Watts): Overload Voltage (Max): Temperature Coefficient:±100ppm/℃ Temperature Coefficient:±100ppm/℃ Operating Temperature Range:-55℃~+155℃ Operating Temperature Range:-55℃~+155℃; LCSC Part Name: 2.2kΩ ±1% 100mW 厚膜电阻; Supplier Part: C4190; Manufacturer: UNI-ROYAL(厚声); Manufacturer Part: 0603WAF2201T5E; Supplier Footprint: 0603; JLCPCB Part Class: Basic Part; Datasheet: https://atta.szlcsc.com/upload/public/pdf/source/20200306/C422600_1E6D84923E4A46A82E41ADD87F860B5C.pdf; Supplier: LCSC; Type: Thick Film Resistors; Tolerance: ±1%; Temperature Coefficient: ±100ppm/℃; Operating Temperature Range: -55℃~+155℃
R8 = 0603WAF3300T5E: Type:Thick Film Resistors Resistance: Tolerance:±1% Tolerance:±1% Power(Watts): Overload Voltage (Max): Temperature Coefficient:±100ppm/℃ Temperature Coefficient:±100ppm/℃ Operating Temperature Range:-55℃~+155℃ Operating Temperature Range:-55℃~+155℃; LCSC Part Name: 330Ω ±1% 100mW 厚膜电阻; Supplier Part: C23138; Manufacturer: UNI-ROYAL(厚声); Supplier Footprint: 0603; JLCPCB Part Class: Basic Part; Datasheet: https://atta.szlcsc.com/upload/public/pdf/source/20200306/C422600_1E6D84923E4A46A82E41ADD87F860B5C.pdf; Supplier: LCSC; Type: Thick Film Resistors; Tolerance: ±1%; Temperature Coefficient: ±100ppm/℃; Operating Temperature Range: -55℃~+155℃
R9 R11 = 0603WAF4702T5E: Type:Thick Film Resistor Resistance:47kΩ Tolerance:±1% Tolerance:±1% Power(Watts):100mW Voltage-Supply(Max):75V Temperature Coefficient:±100ppm/℃ Temperature Coefficient:±100ppm/℃ Operating Temperature:-55℃~+155℃ Operating Temperature:-55℃~+155℃; LCSC Part Name: 47kΩ ±1% 100mW 厚膜电阻; Supplier Part: C25819; Manufacturer: UNI-ROYAL(厚声); Supplier Footprint: 0603; JLCPCB Part Class: Basic Part; Datasheet: https://item.szlcsc.com/datasheet/0603WAF4702T5E/26562.html; Supplier: LCSC; Type: Thick Film Resistor; Tolerance: ±1%; Power(Watts): 100mW; Voltage-Supply(Max): 75V; Temperature Coefficient: ±100ppm/℃; Operating Temperature: -55℃~+155℃
R10 = 0603WAF2200T5E: Type:Thick Film Resistors Resistance: Tolerance:±1% Tolerance:±1% Power(Watts): Overload Voltage (Max): Temperature Coefficient:±100ppm/℃ Temperature Coefficient:±100ppm/℃ Operating Temperature Range:-55℃~+155℃ Operating Temperature Range:-55℃~+155℃; LCSC Part Name: 220Ω ±1% 100mW 厚膜电阻; Supplier Part: C22962; Manufacturer: UNI-ROYAL(厚声); Supplier Footprint: 0603; JLCPCB Part Class: Basic Part; Datasheet: https://atta.szlcsc.com/upload/public/pdf/source/20200306/C422600_1E6D84923E4A46A82E41ADD87F860B5C.pdf; Supplier: LCSC; Type: Thick Film Resistors; Tolerance: ±1%; Temperature Coefficient: ±100ppm/℃; Operating Temperature Range: -55℃~+155℃
R14-R16 R18 R19 R21 R24 R26 = 0603WAF1000T5E: Type:Thick Film Resistors Resistance: Tolerance:±1% Tolerance:±1% Power(Watts): Overload Voltage (Max): Temperature Coefficient:±200ppm/℃ Temperature Coefficient:±200ppm/℃ Operating Temperature Range:-55℃~+155℃ Operating Temperature Range:-55℃~+155℃; LCSC Part Name: 100Ω ±1% 100mW 厚膜电阻; Supplier Part: C22775; Manufacturer: UNI-ROYAL(厚声); Supplier Footprint: 0603; JLCPCB Part Class: Basic Part; Datasheet: https://atta.szlcsc.com/upload/public/pdf/source/20200306/C422600_1E6D84923E4A46A82E41ADD87F860B5C.pdf; Supplier: LCSC; Type: Thick Film Resistors; Tolerance: ±1%; Temperature Coefficient: ±200ppm/℃; Operating Temperature Range: -55℃~+155℃
R17 = 0603WAF1200T5E: Type:Thick Film Resistors Resistance: Tolerance:±1% Tolerance:±1% Power(Watts): Overload Voltage (Max): Temperature Coefficient:±100ppm/℃ Temperature Coefficient:±100ppm/℃ Operating Temperature Range:-55℃~+155℃ Operating Temperature Range:-55℃~+155℃; LCSC Part Name: 120Ω ±1% 100mW 厚膜电阻; Supplier Part: C22787; Manufacturer: UNI-ROYAL(厚声); Supplier Footprint: 0603; JLCPCB Part Class: Basic Part; Datasheet: https://atta.szlcsc.com/upload/public/pdf/source/20200306/C422600_1E6D84923E4A46A82E41ADD87F860B5C.pdf; Supplier: LCSC; Type: Thick Film Resistors; Tolerance: ±1%; Temperature Coefficient: ±100ppm/℃; Operating Temperature Range: -55℃~+155℃
R20 R28 = 0603WAF1002T5E: Type:Thick Film Resistor Resistance:10kΩ Tolerance:±1% Tolerance:±1% Power(Watts):100mW Voltage-Supply(Max):75V Temperature Coefficient:±100ppm/℃ Temperature Coefficient:±100ppm/℃ Operating Temperature:-55℃~+155℃ Operating Temperature:-55℃~+155℃; LCSC Part Name: 厚膜电阻 10kΩ ±1% 100mW; Supplier Part: C25804; Manufacturer: UNI-ROYAL(厚声); Supplier Footprint: 0603; JLCPCB Part Class: Basic Part; Datasheet: https://item.szlcsc.com/datasheet/0603WAF1002T5E/26547.html; Supplier: LCSC; Type: Thick Film Resistor; Tolerance: ±1%; Power(Watts): 100mW; Voltage-Supply(Max): 75V; Temperature Coefficient: ±100ppm/℃; Operating Temperature: -55℃~+155℃
R22 R25 R27 R36 R45 = 0603WAF1003T5E: Type:Thick Film Resistor Resistance:100kΩ Tolerance:±1% Tolerance:±1% Power(Watts):100mW Voltage-Supply(Max):75V Temperature Coefficient:±100ppm/℃ Temperature Coefficient:±100ppm/℃ Operating Temperature:-55℃~+155℃ Operating Temperature:-55℃~+155℃; LCSC Part Name: 100kΩ ±1% 100mW 厚膜电阻; Supplier Part: C25803; Manufacturer: UNI-ROYAL(厚声); Supplier Footprint: 0603; JLCPCB Part Class: Basic Part; Datasheet: https://item.szlcsc.com/datasheet/0603WAF1003T5E/26546.html; Supplier: LCSC; Type: Thick Film Resistor; Tolerance: ±1%; Power(Watts): 100mW; Voltage-Supply(Max): 75V; Temperature Coefficient: ±100ppm/℃; Operating Temperature: -55℃~+155℃
R23 = 0603WAF1001T5E: Type:Thick Film Resistors Resistance:1kΩ Tolerance:±1% Tolerance:±1% Power(Watts): Overload Voltage (Max): Temperature Coefficient:±100ppm/℃ Temperature Coefficient:±100ppm/℃ Operating Temperature Range:-55℃~+155℃ Operating Temperature Range:-55℃~+155℃; LCSC Part Name: 1kΩ ±1% 100mW 厚膜电阻; Supplier Part: C21190; Manufacturer: UNI-ROYAL(厚声); Supplier Footprint: 0603; JLCPCB Part Class: Basic Part; Datasheet: https://atta.szlcsc.com/upload/public/pdf/source/20200306/C422600_1E6D84923E4A46A82E41ADD87F860B5C.pdf; Supplier: LCSC; Type: Thick Film Resistors; Tolerance: ±1%; Temperature Coefficient: ±100ppm/℃; Operating Temperature Range: -55℃~+155℃
R32 R35 = 1206W4F100JT5E: Type:Thick Film Resistor Resistance:10Ω Tolerance:±1% Tolerance:±1% Power(Watts):250mW Voltage-Supply(Max):200V Temperature Coefficient:±400ppm/℃ Temperature Coefficient:±400ppm/℃ Operating Temperature:-55℃~+155℃ Operating Temperature:-55℃~+155℃; LCSC Part Name: 10Ω ±1% 250mW 厚膜电阻; Supplier Part: C17903; Manufacturer: UNI-ROYAL(厚声); Supplier Footprint: 1206; JLCPCB Part Class: Basic Part; Datasheet: https://item.szlcsc.com/datasheet/1206W4F100JT5E/18591.html; Supplier: LCSC; Type: Thick Film Resistor; Tolerance: ±1%; Power(Watts): 250mW; Voltage-Supply(Max): 200V; Temperature Coefficient: ±400ppm/℃; Operating Temperature: -55℃~+155℃
RJ3 = R-RJ11R06P-A800: Supplier Part: C189750; Manufacturer: Ckmtw(灿科盟); Supplier Footprint: 插件; JLCPCB Part Class: Extended Part; Datasheet: https://item.szlcsc.com/datasheet/R-RJ11R06P-A800/203237.html; Supplier: LCSC; Connector Type: RJ11 Jack; Number of Ports: 1
SW1 = TS-1002S-05026C: LCSC Part Name: 6*6*5mm 立贴 轻触开关; Supplier Part: C455110; Manufacturer: XUNPU(讯普); Supplier Footprint: SMD,6x6mm; JLCPCB Part Class: Extended Part; Datasheet: https://atta.szlcsc.com/upload/public/pdf/source/20250513/F8F0C18C3D0EDC07DAC80A3CC3CDA783.pdf; Supplier: LCSC; Circuit: SPST; Actuator Style: Round Button; Mounting Type: Vertical welding; Length: 6mm; Width: 6mm; Switch Height: 5mm; Contact Current: 50mA; Voltage Rating: 12V
TP1 = RH-5004: Connector Type:Pin type (through board) Plastic Color:Yellow Board Space (Diameter φ/ Length x Width):2.5mm; LCSC Part Name: PCB电路板测试点/测试针; Supplier Part: C5199804; Manufacturer: 荣和; JLCPCB Part Class: Extended Part; Supplier: LCSC; Connector Type: Pin type (through board); Plastic Color: Yellow; Board Space (Diameter φ/ Length x Width): 2.5mm
U1 = KH-2PH90-1X25P-L10.5: Pin Structure:1x25P Pitch:2mm Circluar Pins/Square Pins:Pin Header Mounting Type:Right Angle Number of Rows:1 Number of Pins:25P Current Rating:1.5A Length of Mating Pin:4mm Insulation Height:2mm Contact Material:Brass Contact Plating:Gold Operating Tempe; LCSC Part Name: 1x25P 间距:2mm 方针 弯插; Supplier Part: C19631087; Manufacturer: kinghelm(金航标); Supplier Footprint: 弯插,P=2mm; JLCPCB Part Class: Extended Part; Datasheet: https://item.szlcsc.com/datasheet/KH-2PH90-1X25P-L10.5/20923638.html; Supplier: LCSC; Pin Structure: 1x25P; Pitch: 2mm; Circluar Pins/Square Pins: Pin Header; Mounting Type: Right Angle; Number of Rows: 1; Number of Pins: 25P; Current Rating: 1.5A; Length of Mating Pin: 4mm; Insulation Height: 2mm; Contact Material: Brass; Contact Plating: Gold; Operating Temperature: -40℃~+105℃; Color: Black
U2 = STM32L431CCT6: CPU Core:ARM-M4 CPU Maximum Speed:80MHz Program Storage Size:256KB Program Memory Type:FLASH Number of I/O:39 ADC (Bit):12bit DAC (Bit):12bit Voltage - Supply:1.71V~3.6V Voltage - Supply:1.71V~3.6V Applications:-; LCSC Part Name: 带FPU的超低功耗80 Mhz Arm Cortex-M4 MCU，具有256-KB Flash存储器; Supplier Part: C486681; Manufacturer: ST(意法半导体); Supplier Footprint: LQFP-48(7x7); JLCPCB Part Class: Extended Part; Datasheet: https://item.szlcsc.com/datasheet/STM32L431CCT6/495115.html; Supplier: LCSC; CPU Core: ARM-M4; CPU Maximum Speed: 80MHz; Program Storage Size: 256KB; Program Memory Type: FLASH; Number of I/O: 39; ADC (Bit): 12bit; DAC (Bit): 12bit; Voltage - Supply: 1.71V~3.6V
U3 = TC-6615-9.0-160G: LCSC Part Name: 6*6*9mm 卧插 轻触开关; Supplier Part: C6575016; Manufacturer: HCTL(华灿天禄); Supplier Footprint: 插件; JLCPCB Part Class: Extended Part; Datasheet: https://atta.szlcsc.com/upload/public/pdf/source/20230523/20C79B748B4ACB531A66068A8A6BD305.pdf; Supplier: LCSC; Circuit: SPST; Actuator Style: Round Button; Operating Force: 160gf; Mounting Style: Horizontal Plug; Switch Length: 6mm; Switch Width: 6mm; Switch Height: 9mm; Strike Gundam: With bracket; Contact Current: 50mA; Voltage Rating (DC): 12V; Insulation Resistance: 100MΩ; Actuator/Cap Color: Black; With Lamp: None; Mechanical Life: 100000 Times; Operating Temperature: -25℃~+85℃
U4 = AT24C256C-SSHL-T: Supplier Part: C6482; Manufacturer: MICROCHIP(美国微芯); Supplier Footprint: SOIC-8; JLCPCB Part Class: Extended Part; Datasheet: https://atta.szlcsc.com/upload/public/pdf/source/20140704/1457707098744.pdf; Supplier: LCSC; Interface Type: I2C; Memory Size: 256Kbit; Supply Voltage: 1.7V~5.5V; Operating Temperature: -40℃~+85℃
U5 = SN65HVD72DR: LCSC Part Name: 3.3V供电带IEC ESD保护的RS-485收发器; Supplier Part: C48125; Manufacturer: TI(德州仪器); Supplier Footprint: SOIC-8; JLCPCB Part Class: Extended Part; Datasheet: https://www.ti.com/cn/lit/gpn/sn65hvd72; Supplier: LCSC; Type: Transceiver; Number of Drivers: 1; Number of Receivers: 1; Voltage - Supply: 3V~3.6V; Data Rate: 250Kbps; Number of Nodes: 256; ESD Protect: ±15kV; Operating Temperature: -40℃~+125℃; Supply Current (Iq): 950uA; Communication Mode: Half-Duplex
U7 = TPS62162DSGR: Function:Step-down type Output Type:- Voltage - Supply:3V~17V Voltage - Supply:3V~17V Output Voltage:- Output Voltage:- Output Current:1A Frequency - Switching:2.25MHz Frequency - Switching:2.25MHz Operating Temperature:-40℃~+125℃@(TJ) Operating Temperatu; LCSC Part Name: TPS62162DSGR同步降压DC-DC转换器; Supplier Part: C40256; Manufacturer: TI(德州仪器); Supplier Footprint: WSON-8-EP(2x2); JLCPCB Part Class: Extended Part; Datasheet: https://www.ti.com/cn/lit/gpn/tps62162; Supplier: LCSC; Function: Step-down type; Voltage - Supply: 3V~17V; Output Current: 1A; Frequency - Switching: 2.25MHz; Operating Temperature: -40℃~+125℃@(TJ); Synchronous Rectifier: Yes; Number of Outputs: 1; Topology: Step-down; Switch tube (built-in/external): Built-in
X1 = Q13FC13500004_C32346: LCSC Part Name: 32.768kHz ±20ppm 12.5pF; Supplier Part: C32346; Manufacturer: EPSON(爱普生); Manufacturer Part: Q13FC13500004; Supplier Footprint: SMD3215-2P; JLCPCB Part Class: Basic Part; Datasheet: https://atta.szlcsc.com/upload/public/pdf/source/20240418/0E0FF5F0356BA3753F616001439D1416.pdf; Supplier: LCSC; Crystal Type: Surface Mount Crystal; Normal temperature Frequency Tolerance: ±20ppm; Equivalent Series Resistance (ESR): 70kΩ
X2 = X50328MSB2GI: LCSC Part Name: YSX530GA 8MHZ 2P 5032 20PF ±10PPM -40~85℃ (±20PPM); Supplier Part: C115962; Manufacturer: YXC(扬兴晶振); Supplier Footprint: SMD5032-2P; JLCPCB Part Class: Basic Part; Datasheet: https://item.szlcsc.com/datasheet/X50328MSB2GI/117214.html; Supplier: LCSC; Type: Crystal Oscillator; Normal temperature Frequency Tolerance: ±10ppm; Load Capacitance: 20pF; Frequency Stability: ±20ppm; Operating Temperature: -40℃~+85℃

## Nets
+3V3: C7.2 C8.1 C9.1 C10.1 C11.1 C12.1 C17.2 C18.2 C19.2 C22.1 C23.1 C28.1 CN1.3 L2.2 R2.2 R3.2 R4.2 R20.2 R28.2 R29.2 R30.2 R45.2 TP3.1 U1.7 U1.8 U2.9(VDDA/VREF+) U2.24(VDD) U2.36(VDD) U2.48(VDD) U4.2(A1) U4.8(VCC) U5.8(VCC) U6.3(VCC) U7.6(VOS)
+5V: C13.1 C26.1 C27.1 F1.2 LED1.2(+) R44.2 TP2.1 U1.4 U7.2(VIN) U7.3(EN)
+12V: H2.1 H2.3 U1.2
GND: C1.1 C2.1 C3.1 C4.1 C5.1 C6.2 C7.1 C8.2 C9.2 C10.2 C11.2 C12.2 C13.2 C14.1 C15.1 C16.2 C17.1 C18.1 C19.1 C20.2 C21.2 C22.2 C23.2 C25.1 C26.2 C27.2 C28.2 CN1.5 CN1.7 D1.2(A) D2.2(A) D3.2(A) D4.2(A) D5.2(A) D6.2(A) D7.2(A) D8.2(A) D9.2(A) D10.2(A) D11.2(A) D13.2(A) D16.3 D17.3 H2.5 H2.7 Q1.2(S) Q2.2(S) Q3.2(S) R9.1 R11.1 R22.2 R25.2 R27.2 R36.1 R40.1 RJ3.3 RJ3.5 SW1.3 SW1.4 TP1.1 U1.1 U1.3 U1.5 U1.6 U1.14 U1.16 U1.21 U1.25 U2.8(VSSA/VREF-) U2.23(VSS) U2.35(VSS) U2.47(VSS) U3.2 U4.1(A0) U4.3(A2) U4.4(GND) U4.7(WP) U5.2(RE#) U5.5(GND) U6.2(GND) U6.5(LBK) U7.1(PGND) U7.4(AGND) U7.5(FB) U7.9(EP)
VBAT: C6.1 U1.15 U2.1(VBAT)
485_A: D16.1 R32.2 R34.2 RJ3.1 TP22.1
485_B: D16.2 R34.1 R35.2 RJ3.6 TP23.1
BTN_FUNCTION_0: C14.2 R23.2 U2.46(PB9)
CAN_ACTIVE: R43.2 U2.18(PB0)
CAN_H: D17.1 H1.1 L1.4 RJ1.1 RJ2.1 TP12.1
CAN_L: D17.2 L1.3 R38.1 RJ1.2 RJ2.2 TP16.1
CAN_MUTE: R39.1 U2.19(PB1)
CAN_RX: R37.1 U2.32(PA11 (CAN1_RX))
CAN_TX: R1.1 U2.33(PA12 (CAN1_TX))
I2C_SCL: R30.1 R31.2 TP18.1 U4.6(SCL)
I2C_SDA: R29.1 R33.2 TP17.1 U4.5(SDA)
MCU_485_DE: R36.2 TP21.1 U2.11(PA1 (USART2_DE)) U5.3(DE)
MCU_485_RX: TP19.1 U2.13(PA3 (USART2_RX)) U5.1(RO)
MCU_485_TX: TP20.1 U2.12(PA2 (USART2_TX)) U5.4(DI)
MCU_I2C_SCL: R31.1 U2.26(PB13)
MCU_I2C_SDA: R33.1 U2.27(PB14)
MCU_SMB_CLK: R5.1 U2.42(PB6)
MCU_SMB_DATA: R6.1 U2.43(PB7)
MCU_STACK_ENABLE: R8.1 U2.45(PB8)
RESET: C5.2 CN1.12 D9.1(C) R10.1 R28.1 SW1.1 SW1.2 TP11.1
SMB_ALERT: D1.1(C) R2.1 R7.2 U1.24
SMB_CLK: D3.1(C) R4.1 R5.2 U1.22
SMB_DATA: D2.1(C) R3.1 R6.2 U1.23
SMU_SMB_ALERT: R7.1 U2.41(PB5)
STACK_ENABLE: D4.1(C) R8.2 R9.2 U1.20
STATUS_LED_BLU: R21.2 U2.22(PB11)
STATUS_LED_GRN: R24.1 U2.21(PB10)
STATUS_LED_RED: R26.1 U2.10(PA0)
STL_COM_RX: R15.1 U2.30(PA9 (USART1_TX))
STL_COM_TX: R16.1 U2.31(PA10 (USART1_RX))
SWCLK: R13.1 U2.37(PA14(JTCKSWCLK))
SWDIO: R12.1 U2.34(PA13(JTMSSWDIO)
TRACESWO: R14.1 U2.39(PB3(JTDOTRACESWO))
VAUX+: H2.2 R42.2 RJ1.4 RJ2.4
VAUX+2: H2.4 RJ1.5 RJ2.5
VAUX-: H2.6 RJ1.7 RJ1.10(L-) RJ2.7
VAUX-2: H2.8 RJ1.8 RJ2.8
$1N4329: C3.2 U2.5(PH0-OSC_IN(PH0)) X2.2(OSC2)
$1N4330: C4.2 U2.6(PH1-OSC_OUT(PH1)) X2.1(OSC1)
$1N4744: C1.2 U2.3(PC14-OSC32_IN(PC14)) X1.2
$1N4748: C2.2 U2.4(PC15-OSC32_OUT(PC15) X1.1
$1N5436: CN1.8 D8.1(C) R14.2 TP7.1
$1N5439: CN1.13 D5.1(C) R15.2 TP8.1
$1N5442: CN1.6 D7.1(C) R13.2 TP6.1
$1N5443: CN1.4 D6.1(C) R12.2 TP5.1
$1N5454: CN1.14 D10.1(C) R16.2 TP9.1
$1N6636: D11.1(C) R20.1 R23.1 TP10.1 U3.1
$1N6640: Q3.1(G) R26.2 R27.1
$1N6642: Q2.1(G) R24.2 R25.1
$1N6643: Q1.1(G) R21.1 R22.1
$1N6645: Q3.3(D) R17.1
$1N6646: Q2.3(D) R18.1
$1N6647: LED1.1(-) R19.2
$1N6648: LED1.4(-) R18.2
$1N6649: LED1.3(-) R17.2
$1N6650: Q1.3(D) R19.1
$1N26550: R32.1 U5.7(B)
$1N26601: R35.1 U5.6(A)
$1N26770: C15.2 C16.1 D12.1(K) D13.1(K) RJ3.2 RJ3.4 TP24.1
$1N27136: D12.2(A) F1.1
$1N35622: R10.2 U2.7(NRST)
$1N35628: R11.2 TP4.1 U2.44(PH3/BOOT0)
$1N53851: L2.1 U7.7(SW)
$1N53853: R45.1 U7.8(PG)
$3N727: C21.1 L1.1 U6.7(CANH)
$3N732: C20.1 L1.2 U6.6(CANL)
$3N755: H1.2 R38.2
$3N1277: RJ1.13(S) RJ1.14(S) RJ2.13(S) RJ2.14(S)
$3N1411: R42.1 RJ1.9(L+)
$3N1537: R44.1 RJ1.11(R+)
$3N1877: R41.2 RJ1.3 RJ1.6 RJ2.3 RJ2.6
$3N1914: C25.2 R41.1
$3N3836: R1.2 TP13.1 U6.1(D)
$3N3869: R37.2 TP14.1 U6.4(R)
$3N3903: R39.2 R40.2 TP15.1 U6.8(RS)
$3N3934: R43.1 RJ1.12(R-)

Not connected (* = marked no-connect by the designer): CN1 1* 2* 9* 10* 11*; RJ2 9(L+)* 10(L-)* 11(R+)* 12(R-)*; U1 9* 10* 11* 12* 13* 17* 18* 19*; U2 2(PC13)* 14(PA4)* 15(PA5)* 16(PA6)* 17(PA7)* 20(PB2)* 25(PB12)* 28(PB15)* 29(PA8)* 38(PA15(JTDI))* 40(PB4(NJTRST))*; U3 3* 4*

## Notes on the sheets
sheet 1
- MCU
- Stack Bus
- Baseboard Connector
- SWD Header
- SWDIO
- T_VCC
- GND
- SWCLK
- GND
- SWO
- NRST
- 1 cap at each pin, X7R, 50V, 0603
- close to VDDA
- VCP_RX
- VCP_TX
- PSU
- RGB Status LED
- Function Buttons
- RC close to MCU
- Follow Datasheet
  For PCB Layout!
- Reset Button
- I2C
- EEPROM
- RS485
- ADR 0x52
sheet 2
- 6V/us
